# Altium schematic sheet S7CAS-PLEIADES-CARTE-MERE_P06_POWER1.SCHDOC
size Tabloid; SheetNumber: 4; SheetTotal: 18; Sheet_Name: POWER 1; Size: 11x17
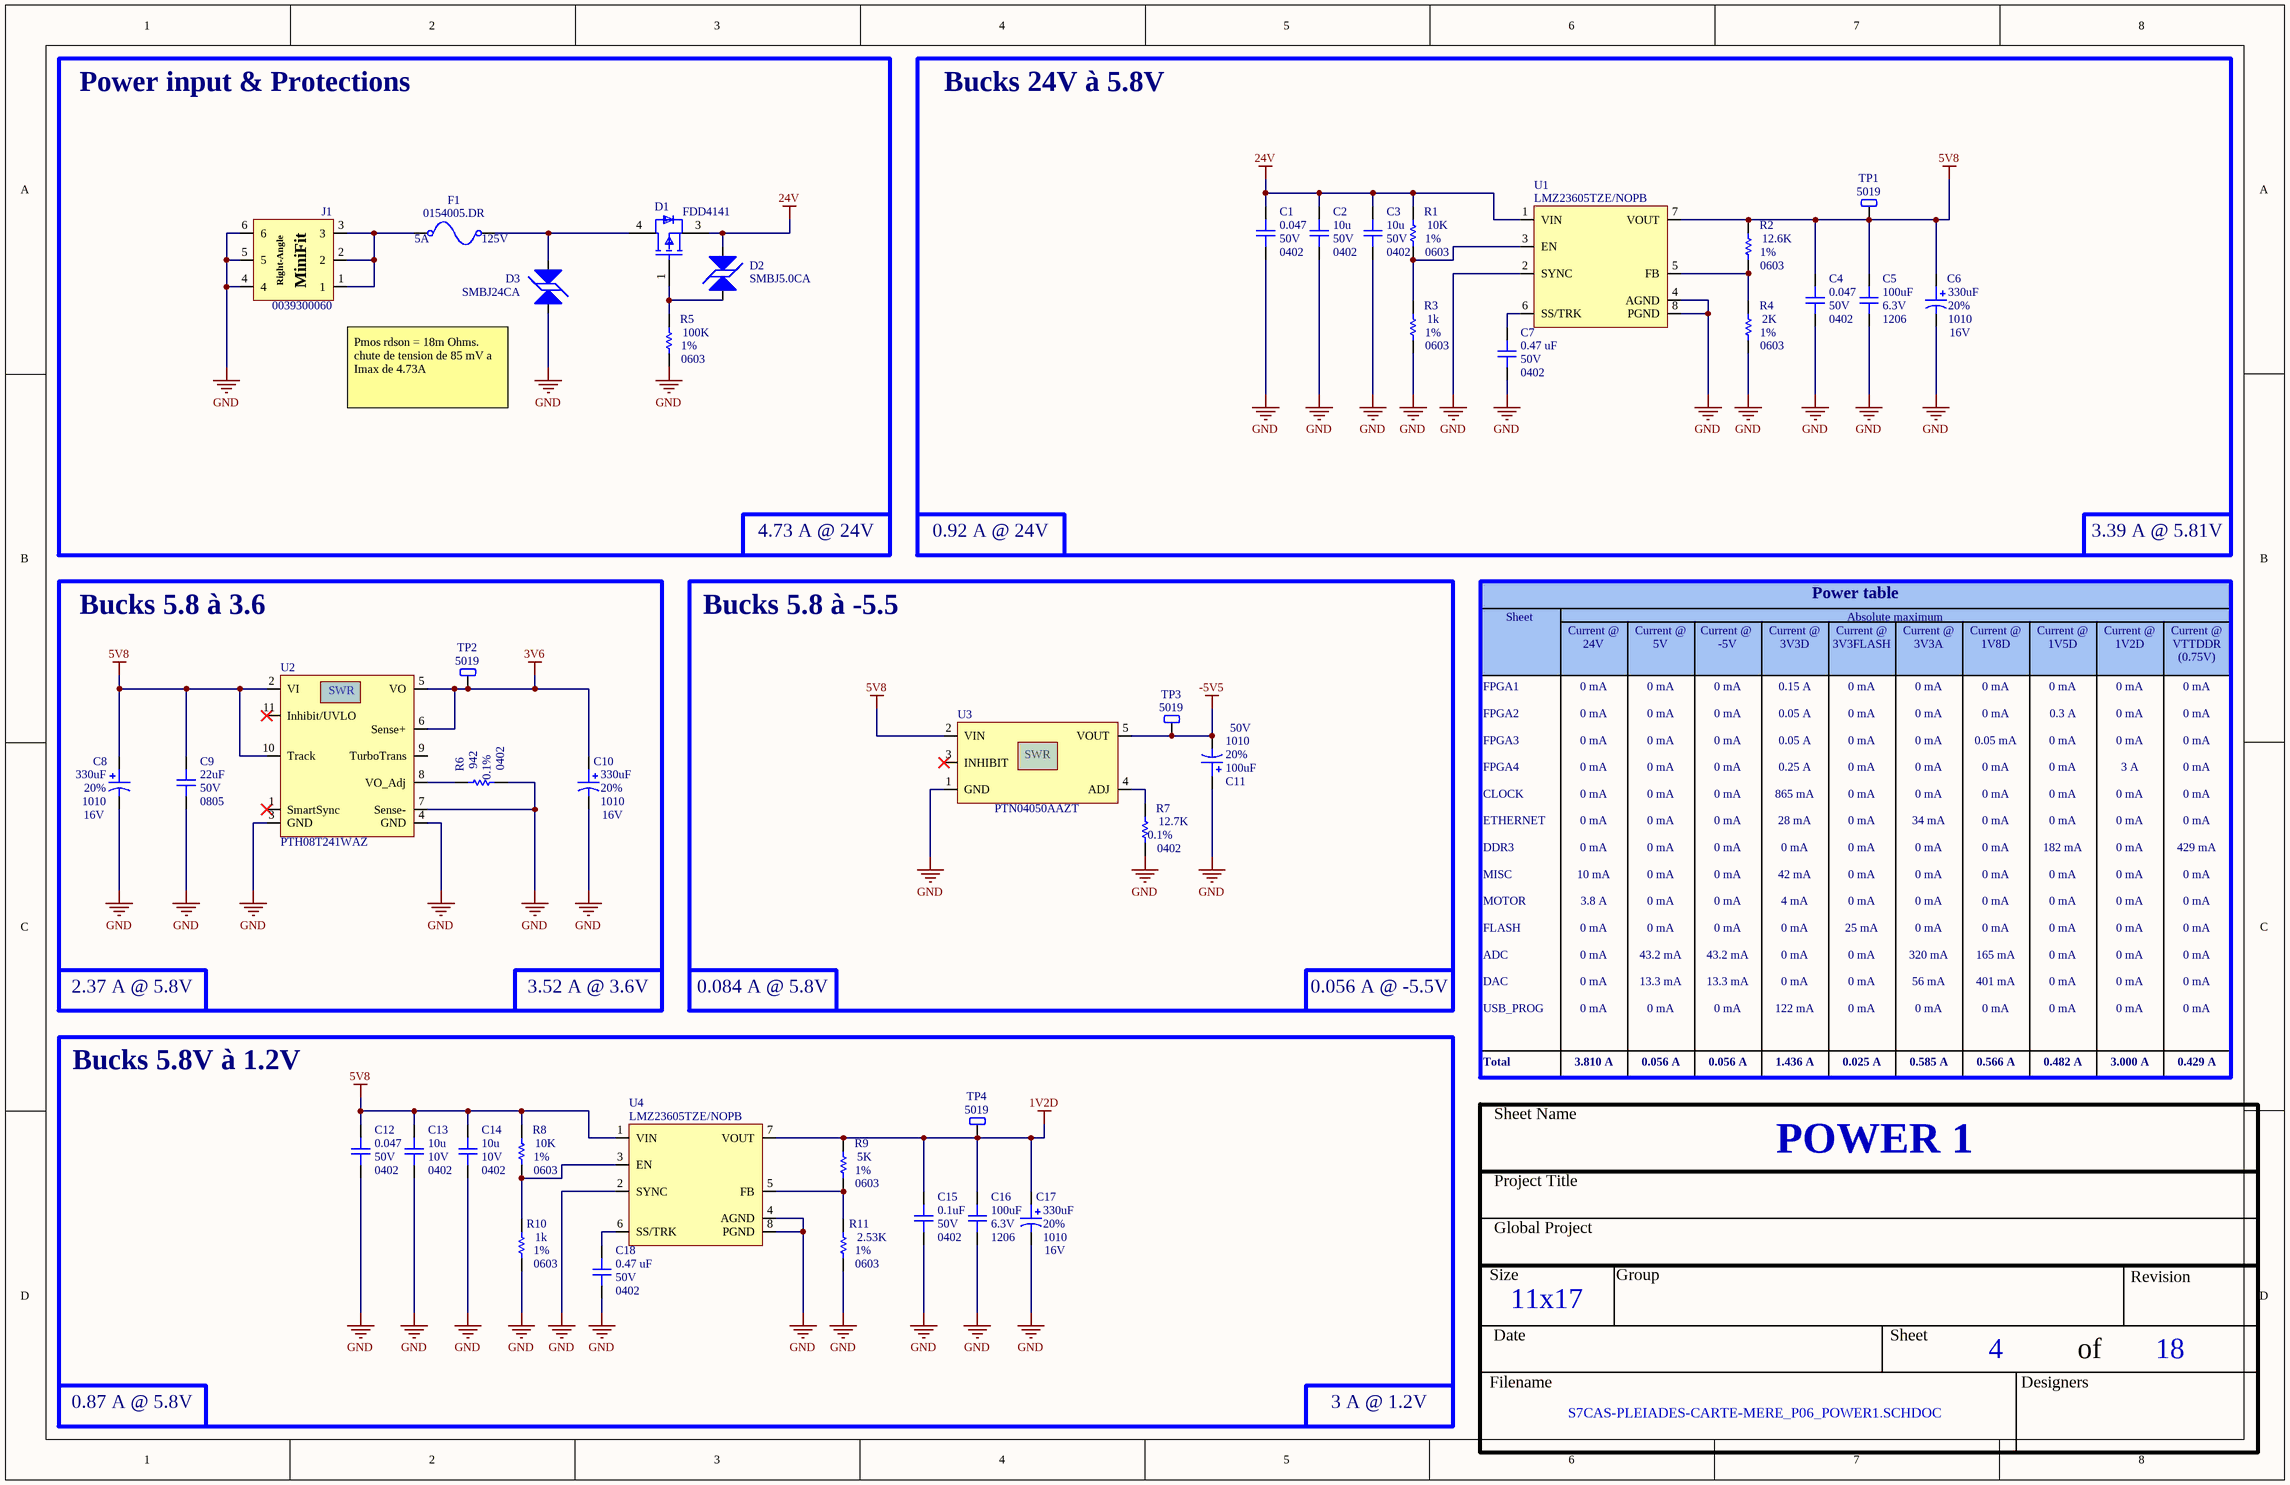
[diagram p0: S7CAS-PLEIADES-CARTE-MERE_P06_POWER1.SCHDOC]

## Parts
C1  value 0.047  Voltage: 50V  Package: 0402  [CAP_0402]  (hidden comment: CAP - 0402)
C2  value 10u  Voltage: 50V  Package: 0402  [CAP_0402]  (hidden comment: CAP - 0402)
C3  value 10u  Voltage: 50V  Package: 0402  [CAP_0402]  (hidden comment: CAP - 0402)
C4  value 0.047  Voltage: 50V  Package: 0402  [CAP_0402]  (hidden comment: CAP - 0402)
C5  value 100uF  Voltage: 6.3V  Package: 1206  [CAP_1206]  (hidden comment: CAP - 1206)
C6  value 330uF  Voltage: 16V  Package: 1010  Precision: 20%  [CAP_ALU_1010_vishay]  (hidden comment: MAL214699501E3)
C7  value 0.47 uF  Voltage: 50V  Package: 0402  [CAP_0402]  (hidden comment: CAP - 0402)
C8  value 330uF  Voltage: 16V  Package: 1010  Precision: 20%  [CAP_ALU_1010_vishay]  (hidden comment: MAL214699501E3)
C9  value 22uF  Voltage: 50V  Package: 0805  [CAP_0805]  (hidden comment: CAP - 0805)
C10  value 330uF  Voltage: 16V  Package: 1010  Precision: 20%  [CAP_ALU_1010_vishay]  (hidden comment: MAL214699501E3)
C11  value 100uF  Voltage: 50V  Package: 1010  Precision: 20%  [CAP_ALU_1010_vishay]  (hidden comment: MAL215099101E3)
C12  value 0.047  Voltage: 50V  Package: 0402  [CAP_0402]  (hidden comment: CAP - 0402)
C13  value 10u  Voltage: 10V  Package: 0402  [CAP_0402]  (hidden comment: CAP - 0402)
C14  value 10u  Voltage: 10V  Package: 0402  [CAP_0402]  (hidden comment: CAP - 0402)
C15  value 0.1uF  Voltage: 50V  Package: 0402  [CAP_0402]  (hidden comment: CAP - 0402)
C16  value 100uF  Voltage: 6.3V  Package: 1206  [CAP_1206]  (hidden comment: CAP - 1206)
C17  value 330uF  Voltage: 16V  Package: 1010  Precision: 20%  [CAP_ALU_1010_vishay]  (hidden comment: MAL214699501E3)
C18  value 0.47 uF  Voltage: 50V  Package: 0402  [CAP_0402]  (hidden comment: CAP - 0402)
D1  FDD4141  [FP-369AS-MFG]
D2  SMBJ5.0CA  [TVS_PWR_SMBJ5.0CA]
D3  SMBJ24CA  [TVS_PWR_SMBJ36CA]
F1  0154005.DR  Voltage Rating: 125V  Current Rating: 5A  [FUS_0154XXX.DR]
J1  0039300060  [CON_MINIFIT_0039300060]
R1  value 10K  Package: 0603  Precision: 1%  [RES_0603]  (hidden comment: RES - 0603)
R2  value 12.6K  Package: 0603  Precision: 1%  [RES_0603]  (hidden comment: RES - 0603)
R3  value 1k  Package: 0603  Precision: 1%  [RES_0603]  (hidden comment: RES - 0603)
R4  value 2K  Package: 0603  Precision: 1%  [RES_0603]  (hidden comment: RES - 0603)
R5  value 100K  Package: 0603  Precision: 1%  [RES_0603]  (hidden comment: RES - 0603)
R6  value 942  Package: 0402  Precision: 0.1%  [RES_0402]  (hidden comment: RES - 0402)
R7  value 12.7K  Package: 0402  Precision: 0.1%  [RES_0402]  (hidden comment: RES - 0402)
R8  value 10K  Package: 0603  Precision: 1%  [RES_0603]  (hidden comment: RES - 0603)
R9  value 5K  Package: 0603  Precision: 1%  [RES_0603]  (hidden comment: RES - 0603)
R10  value 1k  Package: 0603  Precision: 1%  [RES_0603]  (hidden comment: RES - 0603)
R11  value 2.53K  Package: 0603  Precision: 1%  [RES_0603]  (hidden comment: RES - 0603)
TP1  5019  [TPO_SMD_5019]
TP2  5019  [TPO_SMD_5019]
TP3  5019  [TPO_SMD_5019]
TP4  5019  [TPO_SMD_5019]
U1  LMZ23605TZE/NOPB  [REG_SWR_LMZ23605TZE/NOPB]
U2  PTH08T241WAZ  [REG_SWR_PTH08T241WAZ]
U3  PTN04050AAZT  [REG_SWR_PTN04050AAZT]
U4  LMZ23605TZE/NOPB  [REG_SWR_LMZ23605TZE/NOPB]

## Blocks framed on the sheet
Power input & Protections: D1-D3 F1 J1 R5
Bucks 24V à 5.8V: C1-C7 R1-R4 TP1 U1
Bucks 5.8 à 3.6: C8-C10 R6 TP2 U2
Bucks 5.8 à -5.5: C11 R7 TP3 U3
Bucks 5.8V à 1.2V: C12-C18 R8-R11 TP4 U4

## Nets
1V2D: C15.2 C16.2 C17.1 R9.2 TP4.1 U4.7(VOUT)
3V6: C10.1 TP2.1 U2.5(VO) U2.6(Sense+)
5V8: C4.2 C5.2 C6.1 C8.1 C9.2 C12.2 C13.2 C14.2 R2.2 R8.2 TP1.1 U1.7(VOUT) U2.2(VI) U2.10(Track) U3.2(VIN) U4.1(VIN)
24V: C1.2 C2.2 C3.2 D1.3(S) D2.1 R1.2 U1.1(VIN)
-5V5: C11.2 TP3.1 U3.5(VOUT)
GND: C1.1 C2.1 C3.1 C4.1 C5.1 C6.2 C7.1 C8.2 C9.1 C10.2 C11.1 C12.1 C13.1 C14.1 C15.1 C16.1 C17.2 C18.1 D3.2 J1.4 J1.5 J1.6 R3.1 R4.1 R5.1 R6.1 R7.1 R10.1 R11.1 U1.2(SYNC) U1.4(AGND) U1.8(PGND) U2.3(GND) U2.4(GND) U2.7(Sense-) U3.1(GND) U4.2(SYNC) U4.4(AGND) U4.8(PGND)
NetC7_2: C7.2 U1.6(SS/TRK)
NetC18_2: C18.2 U4.6(SS/TRK)
NetD1_1: D1.1(G) D2.2 R5.2
NetD1_4: D1.4(D) D3.1 F1.2
NetF1_1: F1.1 J1.1 J1.2 J1.3
NetR1_1: R1.1 R3.2 U1.3(EN)
NetR2_1: R2.1 R4.2 U1.5(FB)
NetR6_2: R6.2 U2.8(VO_Adj)
NetR7_2: R7.2 U3.4(ADJ)
NetR8_1: R8.1 R10.2 U4.3(EN)
NetR9_1: R9.1 R11.2 U4.5(FB)

Not connected (* = marked no-connect by the designer): U2 1(SmartSync)* 9(TurboTrans) 11(Inhibit/UVLO)*; U3 3(INHIBIT)*

## Notes on the sheet
- Pmos rdson = 18m Ohms. chute de tension de 85 mV a Imax de 4.73A
- 4.73 A @ 24V
- 0.92 A @ 24V
- 3.39 A @ 5.81V
- Power table
- Absolute maximum
- Sheet
- Current @ 24V
- Current @ 5V
- Current @
  -5V
- Current @ 3V3D
- Current @ 3V3FLASH
- Current @ 3V3A
- Current @ 1V8D
- Current @ 1V5D
- Current @ 1V2D
- Current @ VTTDDR
  (0.75V)
- 2.37 A @ 5.8V
- 3.52 A @ 3.6V
- 0.084 A @ 5.8V
- 0.056 A @ -5.5V
- FPGA1
  FPGA2
  FPGA3
  FPGA4
  CLOCK
  ETHERNET
  DDR3
  MISC
  MOTOR
  FLASH
  ADC
  DAC
  USB_PROG
- Total
- 0 mA
  0 mA
  0 mA
  0 mA
  0 mA
  0 mA
  0 mA
  10 mA
  3.8 A
  0 mA
  0 mA
  0 mA
  0 mA
- 3.810 A
- 0.056 A
- 0 mA
  0 mA
  0 mA
  0 mA
  0 mA
  0 mA
  0 mA
  0 mA
  0 mA
  0 mA
  43.2 mA
  13.3 mA
  0 mA
- 1.436 A
- 0.15 A
  0.05 A
  0.05 A
  0.25 A
  865 mA
  28 mA
  0 mA
  42 mA
  4 mA
  0 mA
  0 mA
  0 mA
  122 mA
- 0.025 A
- 0 mA
  0 mA
  0 mA
  0 mA
  0 mA
  0 mA
  0 mA
  0 mA
  0 mA
  25 mA
  0 mA
  0 mA
  0 mA
- 0.585 A
- 0 mA
  0 mA
  0 mA
  0 mA
  0 mA
  34 mA
  0 mA
  0 mA
  0 mA
  0 mA
  320 mA
  56 mA
  0 mA
- 0.566 A
- 0 mA
  0 mA
  0.05 mA
  0 mA
  0 mA
  0 mA
  0 mA
  0 mA
  0 mA
  0 mA
  165 mA
  401 mA
  0 mA
- 0.482 A
- 0 mA
  0.3 A
  0 mA
  0 mA
  0 mA
  0 mA
  182 mA
  0 mA
  0 mA
  0 mA
  0 mA
  0 mA
  0 mA
- 3.000 A
- 0 mA
  0 mA
  0 mA
  3 A
  0 mA
  0 mA
  0 mA
  0 mA
  0 mA
  0 mA
  0 mA
  0 mA
  0 mA
- 0.429 A
- 0 mA
  0 mA
  0 mA
  0 mA
  0 mA
  0 mA
  429 mA
  0 mA
  0 mA
  0 mA
  0 mA
  0 mA
  0 mA
- 0.87 A @ 5.8V
- 3 A @ 1.2V
- Sheet Name
- Project Title
- Global Project
- Size
- Group
- Revision
- Date
- of
- Filename
- Designers
- (in symbol CON_MINIFIT_0039300060) Right-Angle; MiniFit
- (in symbol REG_SWR_PTH08T241WAZ) SWR
- (in symbol REG_SWR_PTN04050AAZT) SWR

## Library data of the parts
C1-C4 C7 C12-C15 C18 = CAP - 0402: Precision: 10%; Current: *; CreatedBy: Jonathan Bouchard; Power: *
C5 C16 = CAP - 1206: Precision: 10%; Current: *; CreatedBy: Jonathan Bouchard; Power: *
C6 C8 C10 C17 = CAP_ALU_MAL214699501E3: CAP - ALU 330uF 20% 16V - 1010; Current: 750mA; Mfg: Vishay Dale; Mfg Part Number: MAL214699501E3; HelpURL: http://www.vishay.com/docs/28403/146cti.pdf; CreatedBy: Jonathan Bouchard; Temperature: -55°C to 125°C; Power: *; Supplier 1: Digikey; Supplier Part Number 1: 4405PHCT-ND
C9 = CAP - 0805: Precision: 10%; Current: *; CreatedBy: Jonathan Bouchard; Power: *
C11 = CAP_ALU_MAL215099101E3: CAP - ALU 100uF 20% 50V - 1010; Current: 490mA; Mfg: Vishay Dale; Mfg Part Number: MAL215099101E3; HelpURL: http://www.vishay.com/docs/28395/150crz.pdf; CreatedBy: Jonathan Bouchard; Temperature: -55°C to 125°C; Power: *; Supplier 1: Digikey; Supplier Part Number 1: 4399PHDKR-ND
D1 = CMP-07173-000088-1: MOSFET P-CH 40V 10.8A DPAK; Manufacturer: ON Semiconductor; Gate Charge At Vgs: 36nC @ -10V; Transconductance: 38S; Drain To Source Breakdown Voltage: -40V; Reverse Recovery Time: 29ns; Pulse Drain Current: -100A; Reverse Recovery Charge: 26nC; Drain To Source Resistance: 10.1mΩ; Power Dissipation: 2.4W; Max Forward Diode Voltage: -1.2V; Turn Off Delay Time: 38ns; Number Of P Channels: 1; Gate To Source Voltage: 20V; Rthja Max: 52°C/W; Depletion Mode: False; Threshold Vgs Max: -3V; Threshold Vgs Min: -1V; Turn On Delay Time: 10ns; Max Junction Temp: +150°C; Input Capacitace At Vds: 2085pF @ -20V; Continuous Drain Current: -10.8A; Typ Forward Diode Voltage: -0.8V; Package: 369AS; Category: Diode; RoHS: TRUE; Device Class L2: Transistors; Octopart: https://octopart.com/fdd4141-on+semiconductor-84325802; Temperature: -55°C to +150°C; Drain To Source Voltage: -40V; Device Class L1: Discrete Semiconductors; Temperature Range Low: -55°C; Height: 2.517mm; ComponentLink2Description: Datasheet; Automotive: No; Number Of Channels: 1; Digikey Description: MOSFET P-CH 40V 10.8A DPAK; Lead Free: Yes; Manufacturer Part Number: FDD4141; Temperature Range High: +150°C; Footprint Url: https://www.onsemi.com/pub/Collateral/369AS.PDF; Device Class L3: MOSFETs; Mouser Description: MOSFET -40V P-Channel PowerTrench; ComponentLink2URL: https://www.onsemi.com/pub/Collateral/FDD4141-D.pdf
D2 = TVS_PWR_SMBJ5.0CA: TVS - BIDIR 5V 9.2V 600W - DO214AA; Manufacturer #1: Littelfuse Inc.; Value: Vbr = 6.4V -  Clamp = 9.2V; Voltage Rating: 5V Standoff; Current Rating: 65.3 A (Ipp); Power Max: 600W (Pppm); GRAMS Lib Spec: 2.8; Magnetic Material: UNKNOWN; Polarized: NO; Tolerance: *; HelpURL: http://www.littelfuse.com/~/media/electronics/datasheets/tvs_diodes/littelfuse_tvs_diode_smbj_datasheet.pdf.pdf; CreatedBy/Date: Jonathan Bouchard - 2019-03-22; VerifiedBy: Nicolas V. (2019-05-06); Temperature: -65°C ~ 150°C (TJ); Package: DO214AA; Manufacturer #2: *; Note: *; Assembly Type: SMD; Part Number #2: *; Part Number #1: SMBJ5.0CA; Supplier 1: Digi-Key; Supplier Part Number 1: SMBJ5.0CALFCT-ND; Cryo: UNKNOWN
D3 = TVS_PWR_SMBJ24CA: TVS - 24V 26.7V 600W - DO214AA; Manufacturer #1: Littelfuse Inc.; Value: Vbr = 26.7V -  Clamp = 38.9V; Voltage Rating: 24V Standoff; Current Rating: 15.5A; GRAMS Lib Spec: 2.8; Magnetic Material: UNKNOWN; Polarized: NO; Tolerance: *; Power Max: 600W; HelpURL: http://www.littelfuse.com/~/media/electronics/datasheets/tvs_diodes/littelfuse_tvs_diode_smbj_datasheet.pdf.pdf; CreatedBy/Date: Arnaud Samson - 06/07/18; VerifiedBy: Jonathan Bouchard - 2018-07-13; Temperature: -65°C ~ 150°C (TJ); Package: DO214AA; Manufacturer #2: *; Note: *; Assembly Type: SMD; Part Number #2: *; Part Number #1: SMBJ24CA; Supplier 1: Digi-Key; Supplier Part Number 1: SMBJ24CALFCT-ND; Cryo: UNKNOWN
F1 = FUS_0154005.DR: FUS - 5 A 125 VAC/VDC - 2-SMD; Manufacturer #1: Littelfuse Inc.; Value: 5A 125V AC/DC FAST; GRAMS Lib Spec: 2.8; Magnetic Material: UNKNOWN; Polarized: NO; Tolerance: *; Power Max: *; HelpURL: http://www.littelfuse.com/~/media/electronics/datasheets/fuses/littelfuse_fuse_154_154t_154l_154tl_datasheet.pdf.pdf; CreatedBy/Date: Arnaud Samson - 06/07/18; VerifiedBy: Jonathan Bouchard 2018-07-16; Temperature: -55°C ~ 125°C; Package: 2-SMD; Manufacturer #2: *; Note: *; Assembly Type: SMD; Part Number #2: *; Part Number #1: 0154005.DR; Supplier 1: Digi-Key; Supplier Part Number 1: F1228CT-ND; Cryo: UNKNOWN
J1 = CON_MINIFIT_0039300060: CON - Mini-Fit Through Hole, Right Angle 6 position; Manufacturer #1: Molex; Current Rating: 8A; GRAMS Lib Spec: 2.8; Magnetic Material: Unknown; Polarized: Yes; Voltage Rating: 600V; Assembly Type: TH; CreatedBy/Date: Joel Lemay 2018-06-21; HelpURL: https://www.molex.com/pdm_docs/sd/039300060_sd.pdf; Manufacturer #2: *; Package: TH; Part Number #1: 0039300060; Part Number #2: *; Power Max: *; Supplier 1: Digi-Key; Supplier Part Number 1: WM21353-ND; Temperature: - 40°C to + 80°C; Tolerance: *; Value: *; VerifiedBy: Caroline Paulin - 10 sept 2018; Cryo: UNKNOWN
R6 R7 = RES - 0402: Voltage: 50V; Power: 1/16W; Current: *; CreatedBy: Jonathan Bouchard
TP1-TP4 = TPO_SMD_5019: TPO - PC TEST POINT MINI - SMD; Manufacturer #1: Keystone Electronics; Value: 3.81mm x 2.03mm; Polarized: No; Magnetic Material: UNKNOWN; GRAMS Lib Spec: 2.8; Current Rating: *; Manufacturer #2: *; Note: *; Power Max: *; Part Number #2: *; HelpURL: https://www.digikey.ca/product-detail/en/keystone-electronics/5019/36-5019CT-ND/3907344; Supplier 1: Digi-Key; Supplier Part Number 1: 36-5019CT-ND; Assembly Type: SMD; Part Number #1: 5019; Package: SMD; CreatedBy/Date: Olivier Bernard / 5/12/2017; Temperature: *; Tolerance: *; VerifiedBy: Caroline Paulin / 5 juillet 2018; Voltage Rating: *; Cryo: UNKNOWN
U1 U4 = REG_SWR_LMZ23605TZE/NOPB: REG - IC BUCK SYNC 36V 5A - TO-PMOD-7; Manufacturer #1: Texas Instruments; Value: 0.8 ~ 6 V; Voltage Rating: 6 ~ 36 V; GRAMS Lib Spec: 2.8; Note: One Reflow; Magnetic Material: YES; Cryo: UNKNOWN; Tolerance: *; Current Rating: 5A; Power Max: *; HelpURL: http://www.ti.com/lit/ds/symlink/lmz23605.pdf; CreatedBy/Date: Arnaud Samson - 05/07/18; VerifiedBy: Jonathan Bouchard 2018-07-13; Temperature: -40°C ~ 125°C; Package: TO-PMOD-7; Manufacturer #2: *; Assembly Type: SMD; Part Number #2: *; Part Number #1: LMZ23605TZE/NOPB; Polarized: YES; Supplier 1: Digi-Key; Supplier Part Number 1: 296-35357-1-ND
U2 = REG_SWR_PTH08T241WAZ: REG - MODULE PIP 10A 14VIN - 11-SMD; Manufacturer #1: Texas Instruments; Current Rating: 10A (out); Voltage rating: 4.5-14V (Input), 0.69 - 5.5V (Out); Polarized: Yes; Magnetic Material: UNKNOWN; Manufacturer #2: *; Note: *; Power Max: *; Value: *; Part Number #1: PTH08T241WAZ; Part Number #2: *; HelpURL: http://www.ti.com/lit/ds/symlink/pth08t241w.pdf; Supplier 1: Digi-Key; Supplier Part Number 1: 296-21339-ND; Assembly Type: SMD; Temperature: -40°C ~ 85°C; Package: SMD; CreatedBy/Date: Olivier Bernard / 6/5/2018; VerifiedBy: Caroline Paulin / 10 juillet 2018; Cryo: UNKNOWN
U3 = REG_SWR_PTN04050AAZT: REG - SWR -15 ~ -3.3V 1A 6W - 5-SMD; Manufacturer #1: Texas Instruments; Voltage Rating: 2.9V~7Vin; GRAMS Lib Spec: 2.8; Magnetic Material: Unknown; Polarized: Yes; Value: -15 ~ -3.3V; Tolerance: *; Current Rating: 1A; Power Max: 6W; HelpURL: http://www.ti.com/lit/ds/symlink/ptn04050a.pdf; CreatedBy/Date: Ihsane Najahi 2019-09-25; VerifiedBy: C.Paulin (9-10-2019); Temperature: -40°C ~ 85°C; Package: 5-SMD; Manufacturer #2: *; Note: *; Assembly Type: 5-SMD; Part Number #2: *; Part Number #1: PTN04050AAZT; Supplier 1: Digi-Key; Supplier Part Number 1: 296-32208-1-ND; Cryo: UNKNOWN
R1-R5 R8-R11 = RES - 0603: Current: *; CreatedBy: Jonathan Bouchard